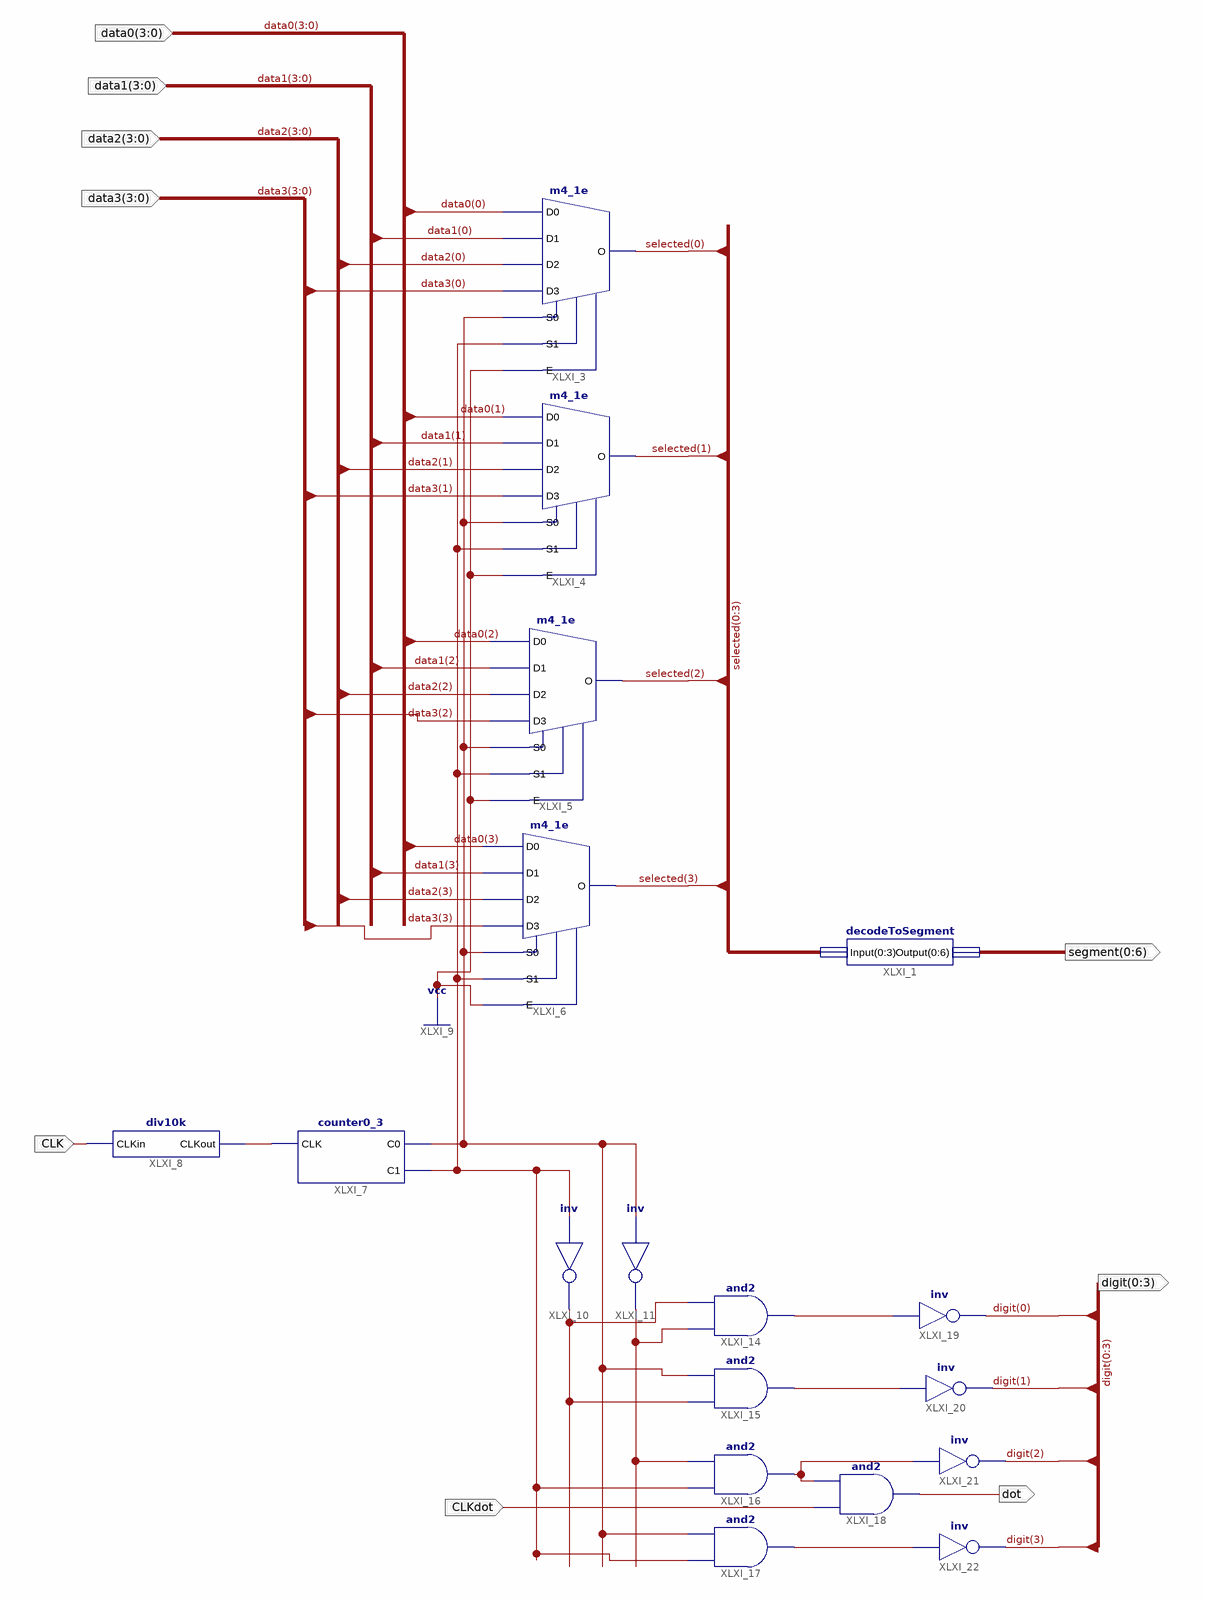
[diagram p0: schematic sheet 1]
// Xilinx ISE schematic displayV2.sch (spartan6) as structural Verilog: 18 symbols, 9 ports
module displayV2 (
  input  [3:0] data0,
  input  [3:0] data1,
  input  [3:0] data2,
  input  [3:0] data3,
  input  CLK,
  input  CLKdot,
  output [0:6] segment,
  output dot,
  output [0:3] digit
);

  wire XLXN_26, XLXN_27, XLXN_29, XLXN_39, XLXN_42, XLXN_68, XLXN_70, XLXN_74, XLXN_75;
  wire [3:0] selected;

  decodeToSegment XLXI_1 (.Input({selected[0], selected[1], selected[2], selected[3]}), .Output(segment));
  m4_1e XLXI_3 (
    .D0(data0[0]), .D1(data1[0]), .D2(data2[0]), .D3(data3[0]), .E(1'b1), .S0(XLXN_26), .S1(XLXN_27),
    .O(selected[0]));
  m4_1e XLXI_4 (
    .D0(data0[1]), .D1(data1[1]), .D2(data2[1]), .D3(data3[1]), .E(1'b1), .S0(XLXN_26), .S1(XLXN_27),
    .O(selected[1]));
  m4_1e XLXI_5 (
    .D0(data0[2]), .D1(data1[2]), .D2(data2[2]), .D3(data3[2]), .E(1'b1), .S0(XLXN_26), .S1(XLXN_27),
    .O(selected[2]));
  m4_1e XLXI_6 (
    .D0(data0[3]), .D1(data1[3]), .D2(data2[3]), .D3(data3[3]), .E(1'b1), .S0(XLXN_26), .S1(XLXN_27),
    .O(selected[3]));
  counter0_3 XLXI_7 (.CLK(XLXN_29), .C0(XLXN_26), .C1(XLXN_27));
  div10k XLXI_8 (.CLKin(CLK), .CLKout(XLXN_29));
  not XLXI_10 (XLXN_39, XLXN_27);
  not XLXI_11 (XLXN_42, XLXN_26);
  and XLXI_14 (XLXN_68, XLXN_42, XLXN_39);
  and XLXI_15 (XLXN_70, XLXN_39, XLXN_26);
  and XLXI_16 (XLXN_74, XLXN_27, XLXN_42);
  and XLXI_17 (XLXN_75, XLXN_27, XLXN_26);
  and XLXI_18 (dot, CLKdot, XLXN_74);
  not XLXI_19 (digit[0], XLXN_68);
  not XLXI_20 (digit[1], XLXN_70);
  not XLXI_21 (digit[2], XLXN_74);
  not XLXI_22 (digit[3], XLXN_75);
endmodule
